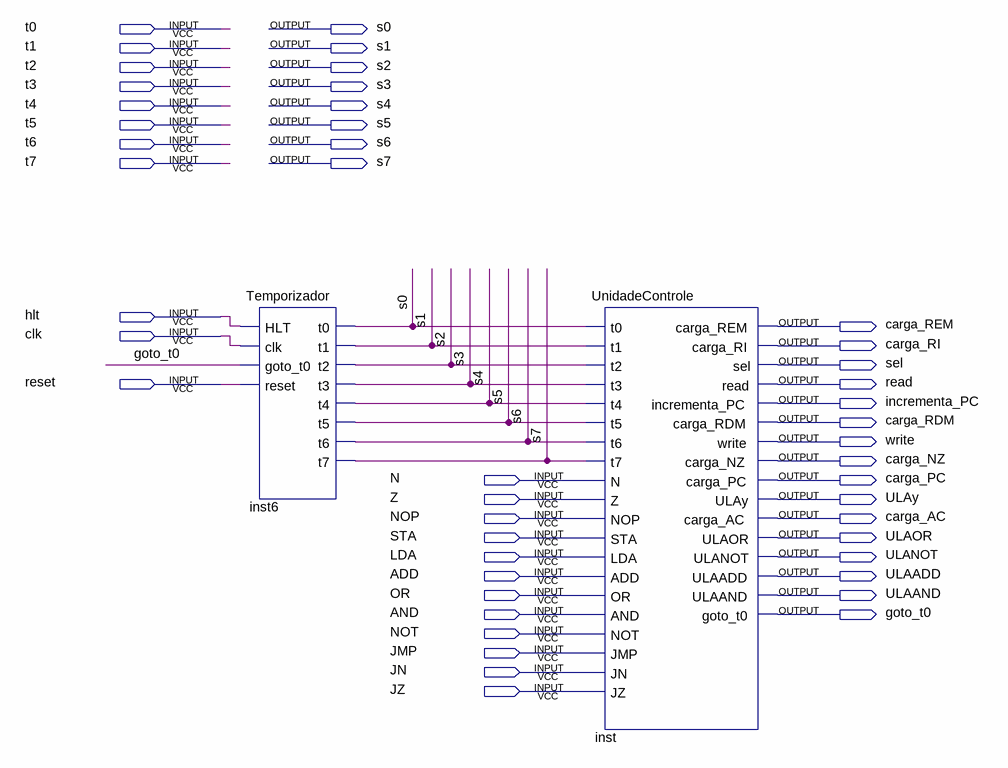
[diagram p0: schematic sheet]
// Quartus schematic Projeto.bdf as structural Verilog: 2 symbols, 47 pins
module Projeto (
  input  t0,
  input  t1,
  input  t2,
  input  t3,
  input  t4,
  input  t5,
  input  t6,
  input  t7,
  input  hlt,
  input  clk,
  input  reset,
  input  N,
  input  Z,
  input  NOP,
  input  STA,
  input  LDA,
  input  ADD,
  input  OR,
  input  AND,
  input  NOT,
  input  JMP,
  input  JN,
  input  JZ,
  output s0,
  output s1,
  output s2,
  output s3,
  output s4,
  output s5,
  output s6,
  output s7,
  output carga_REM,
  output carga_RI,
  output sel,
  output read,
  output incrementa_PC,
  output carga_RDM,
  output write,
  output carga_NZ,
  output carga_PC,
  output ULAy,
  output carga_AC,
  output ULAOR,
  output ULANOT,
  output ULAADD,
  output ULAAND,
  output goto_t0
);

  Temporizador inst6 (
    .HLT(hlt), .clk(clk), .goto_t0(goto_t0), .reset(reset), .t0(s0), .t1(s1), .t2(s2), .t3(s3), .t4(s4),
    .t5(s5), .t6(s6), .t7(s7));
  UnidadeControle inst (
    .t0(s0), .t1(s1), .t2(s2), .t3(s3), .t4(s4), .t5(s5), .t6(s6), .t7(s7), .N(N), .Z(Z), .NOP(NOP),
    .STA(STA), .LDA(LDA), .ADD(ADD), .OR(OR), .AND(AND), .NOT(NOT), .JMP(JMP), .JN(JN), .JZ(JZ),
    .carga_REM(carga_REM), .carga_RI(carga_RI), .sel(sel), .read(read), .incrementa_PC(incrementa_PC),
    .carga_RDM(carga_RDM), .write(write), .carga_NZ(carga_NZ), .carga_PC(carga_PC), .ULAy(ULAy),
    .carga_AC(carga_AC), .ULAOR(ULAOR), .ULANOT(ULANOT), .ULAADD(ULAADD), .ULAAND(ULAAND), .goto_t0(goto_t0));
endmodule
